# EAGLE design garage_door_remote (EAGLE 6.5.0)
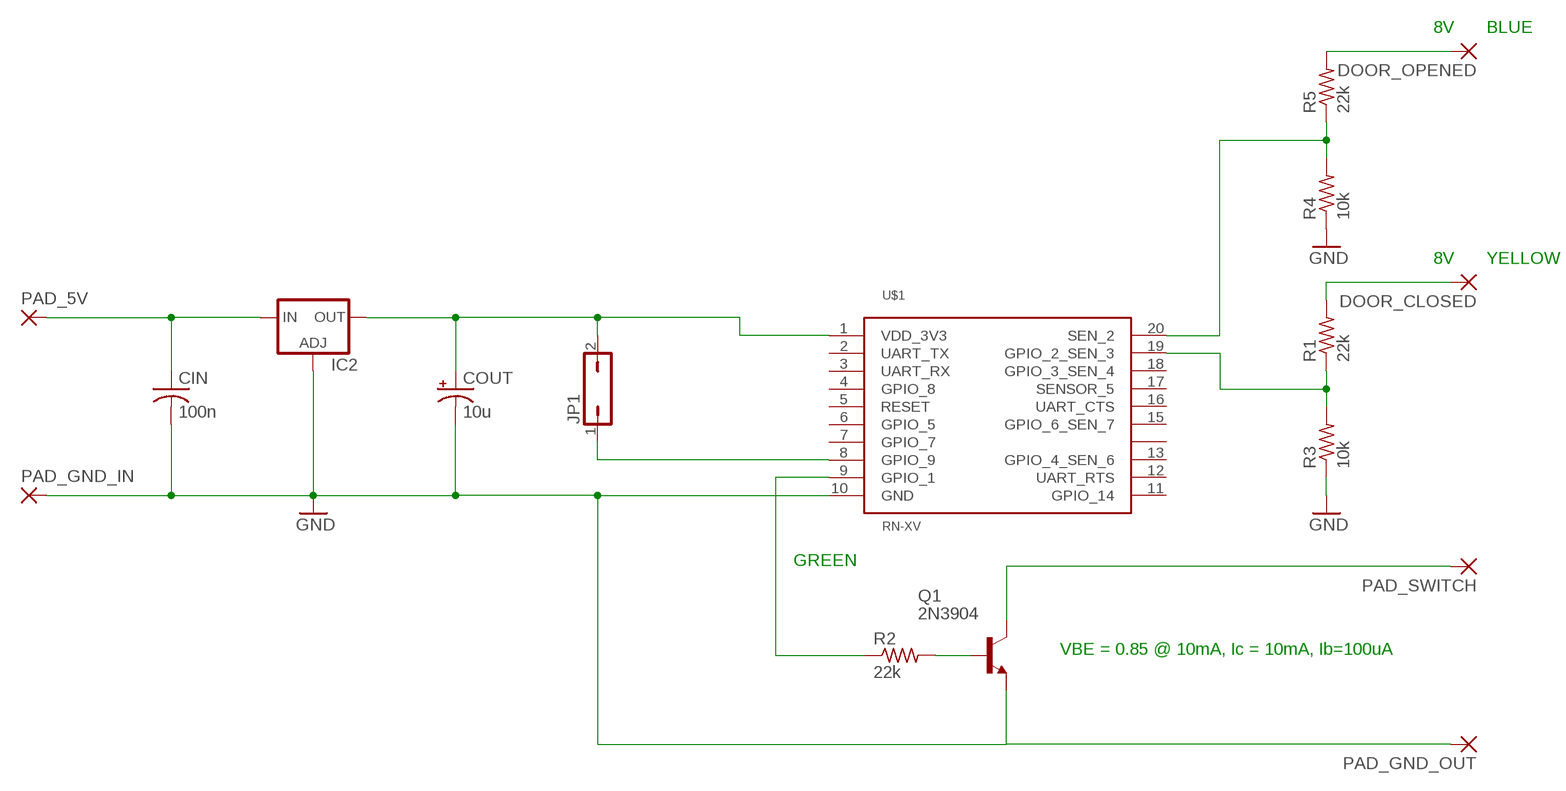
[diagram p0: schematic, sheet 1]

## Parts
CIN  100n  C-US025-024X044  [C025-024X044]
COUT  10u  CPOL-USE2,5-6E  [E2,5-6E]
DOOR_CLOSED  2,54/1,0  [2,54/1,0]
DOOR_OPENED  2,54/1,0  [2,54/1,0]
IC2  LM317TS  [317TS]
JP1  JP1Q  [JP1]
PAD_5V  2,54/1,0  [2,54/1,0]
PAD_GND_IN  2,54/1,0  [2,54/1,0]
PAD_GND_OUT  2,54/1,0  [2,54/1,0]
PAD_SWITCH  2,54/1,0  [2,54/1,0]
Q1  2N3904  [TO92]
R1  22k  R-US_0207/12  [0207/12]
R2  22k  R-US_0207/12  [0207/12]
R3  10k  R-US_0207/12  [0207/12]
R4  10k  R-US_0204/2V  [0204V]
R5  22k  R-US_0204/2V  [0204V]
U$1  RN-XV  [RN-XV]

## Nets
GND: CIN.2 COUT.- IC2.1(ADJ) PAD_GND_IN.1(P) PAD_GND_OUT.1(P) Q1.3(E) R3.1 R4.1 U$1.10(GND)
N$1: JP1.1 U$1.8(GPIO_9)
N$2: COUT.+ IC2.2(OUT) JP1.2 U$1.1(VDD_3V3)
N$3: Q1.2(B) R2.2
N$4: R1.1 R3.2 U$1.19(GPIO_2_SEN_3)
N$5: R4.2 R5.1 U$1.20(SEN_2)
N$6: R2.1 U$1.9(GPIO_1)
N$7: PAD_SWITCH.1(P) Q1.1(C)
N$8: CIN.1 IC2.3(IN) PAD_5V.1(P)
N$9: DOOR_OPENED.1(P) R5.2
N$10: DOOR_CLOSED.1(P) R1.2
Unconnected: U$1.2(UART_TX) U$1.3(UART_RX) U$1.4(GPIO_8) U$1.5(RESET) U$1.6(GPIO_5) U$1.7(GPIO_7) U$1.11(GPIO_14) U$1.12(UART_RTS) U$1.13(GPIO_4_SEN_6) U$1.14(NOT_USED) U$1.15(GPIO_6_SEN_7) U$1.16(UART_CTS) U$1.17(SENSOR_5) U$1.18(GPIO_3_SEN_4)

## Notes on the sheet
- 8V | BLUE
- 8V | YELLOW
- GREEN
- VBE = 0.85 @ 10mA, Ic = 10mA, Ib=100uA

## Library data of the parts
CIN = resistor:C-US: CAPACITOR, American symbol
COUT = resistor:CPOL-US: POLARIZED CAPACITOR, American symbol
DOOR_CLOSED DOOR_OPENED PAD_5V PAD_GND_IN PAD_GND_OUT PAD_SWITCH = wirepad:2,54/1,0: THROUGH-HOLE PAD
IC2 = v-reg:LM317TS: VOLTAGE REGULATOR
JP1 = jumper:JP1Q: JUMPER
Q1 = transistor-npn:2N3904: NPN Transistor
R1-R5 = resistor:R-US_: RESISTOR, American symbol
U$1 = roving-networks:RN-XV: 802.11 b/g module

## Board
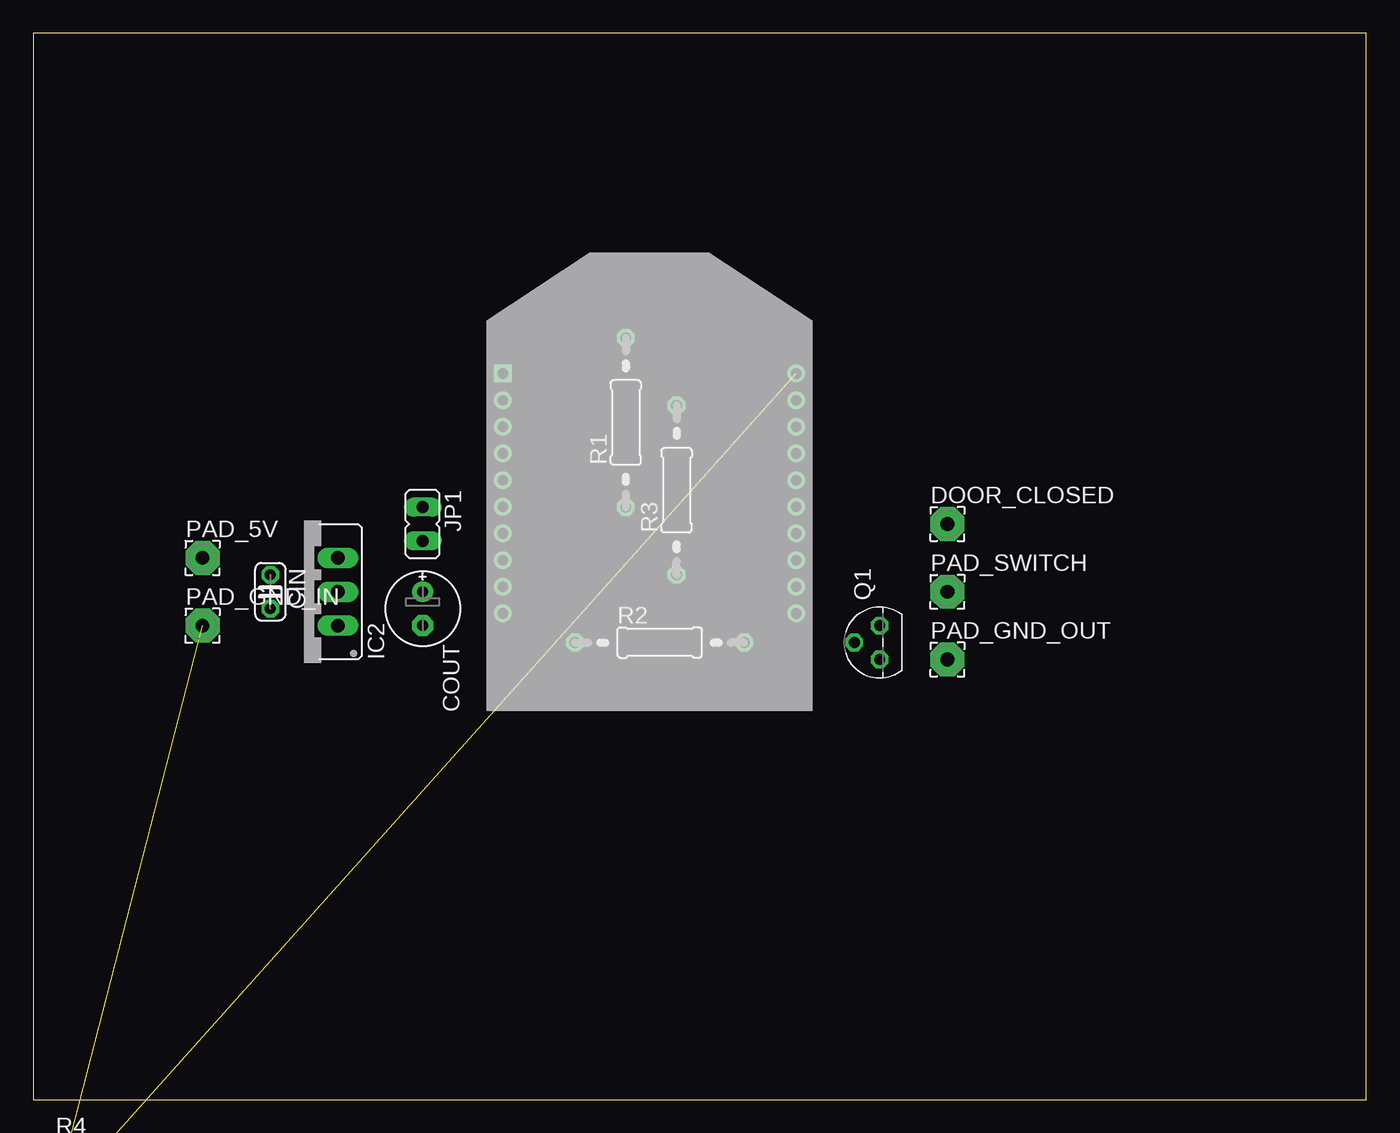
[diagram p1: board, top side]
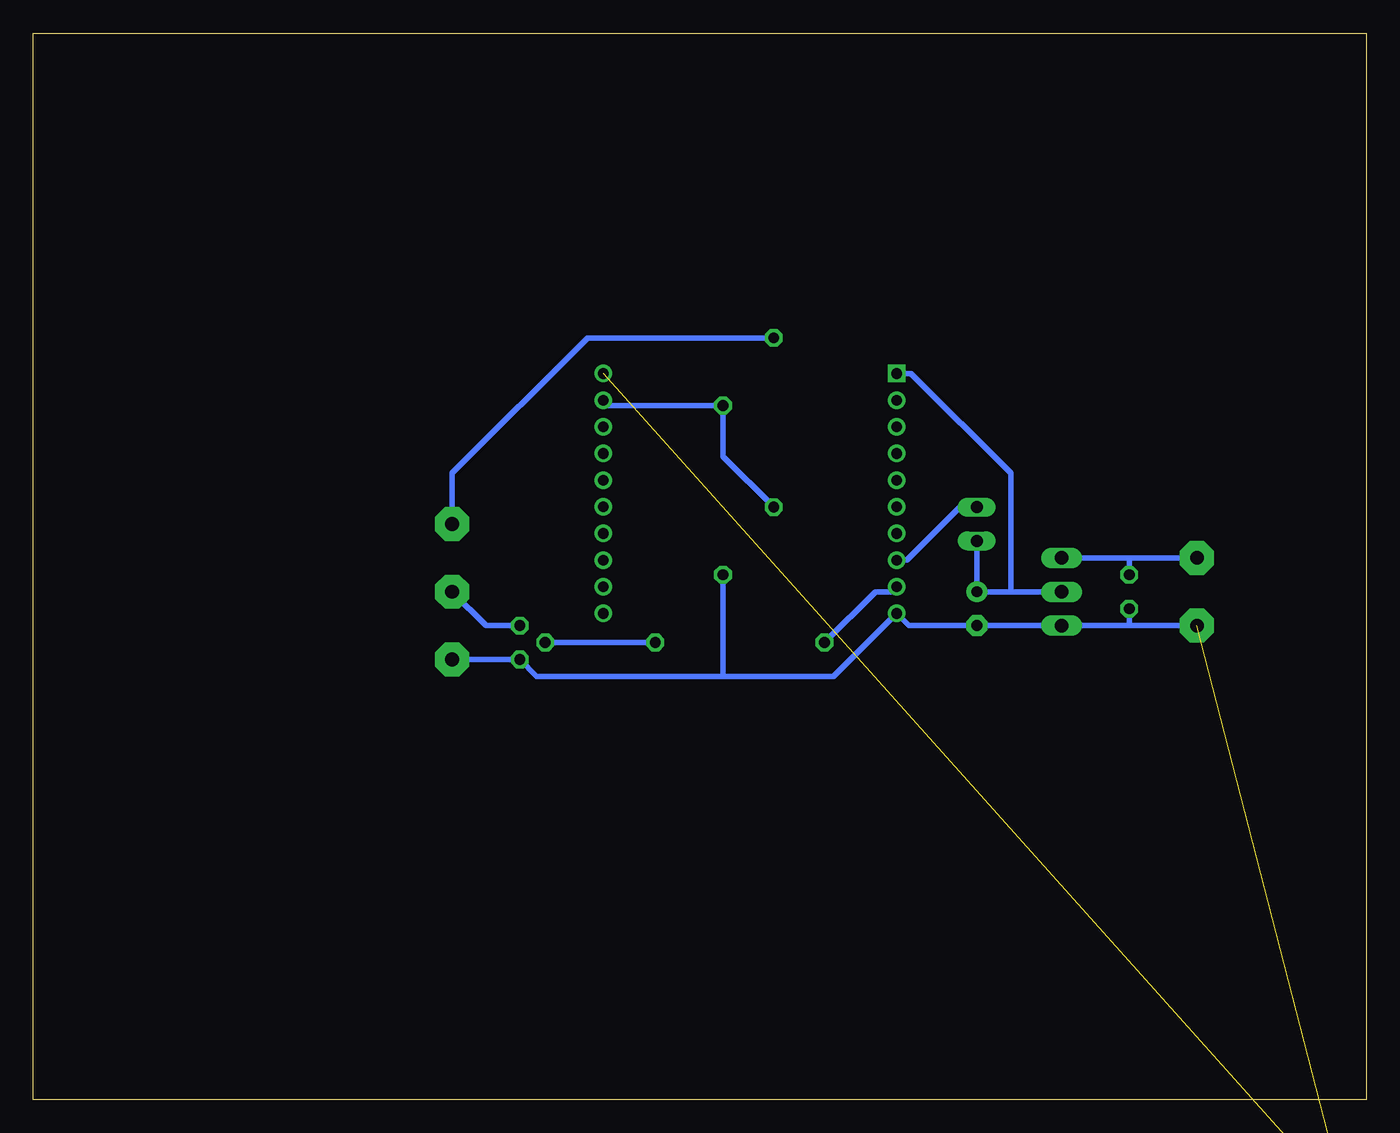
[diagram p2: board, bottom side, seen from below]

Size 100 x 80 mm. Coordinates in mm from the lower left corner, seen from the top.
Outline: 0,0 100,0 100,80 0,80 0,0
Copper layers (1*16): Top 0.035mm / dielectric 1.5mm / Bottom 0.035mm
Design rules "default": minimum track width 10mil, minimum drill 24mil, track to track 8mil, track to pad 8mil, pad to pad 8mil, via to via 8mil, smd to smd 8mil, copper to edge 40mil, drill to drill 8mil, minimum pad ring 10mil, minimum via ring 8mil, stop-mask expansion 4mil, vias tented up to drill 0mil, thermal gap 10mil

### Footprints (pad centres in the part's own frame; a part is rotated, then mirrored left to right if it is on the bottom)
C025-024X044 = drill 0.813 octagon: 1 -1.27,0; 2 1.27,0
E2,5-6E = drill 0.813 pad 1.575: + -1.27,0 | drill 0.813 pad 1.575 octagon: - 1.27,0
2,54/1,0 = drill 1.016 pad 2.54 octagon: 1 0,0
317TS = drill 1.016 long: 1 -2.54,-2.54; 2 0,-2.54; 3 2.54,-2.54
JP1 = drill 0.914 long: 1 0,-1.27; 2 0,1.27
TO92 = drill 0.813 octagon: 1 1.27,0; 2 0,1.905; 3 -1.27,0
0207/12 = drill 0.813 octagon: 1 -6.35,0; 2 6.35,0
0204V = drill 0.813 octagon: 1 -1.27,0; 2 1.27,0
RN-XV = drill 0.8 square: 1 25.264,23.193 | drill 0.8: 2 23.264,23.193; 3 21.264,23.193; 4 19.264,23.193; 5 17.264,23.193; 6 15.264,23.193; 7 13.264,23.193; 8 11.264,23.193; 9 9.264,23.193; 10 7.264,23.193; 11 7.264,1.194; 12 9.264,1.194; 13 11.264,1.194; 14 13.264,1.194; 15 15.264,1.194; 16 17.264,1.194; 17 19.264,1.194; 18 21.264,1.194; 19 23.264,1.194; 20 25.264,1.194

### Placement (x,y rotation side)
CIN  17.78,38.1 270 top
COUT  29.21,36.83 270 top
DOOR_CLOSED  68.58,43.18 0 top
DOOR_OPENED  2.54,-13.97 0 top  (outside the outline)
IC2  20.32,38.1 90 top
JP1  29.21,43.18 180 top
PAD_5V  12.7,40.64 0 top
PAD_GND_IN  12.7,35.56 0 top
PAD_GND_OUT  68.58,33.02 0 top
PAD_SWITCH  68.58,38.1 0 top
Q1  63.5,34.29 90 top
R1  44.45,50.8 90 top
R2  46.99,34.29 0 top
R3  48.26,45.72 90 top
R4  3.81,-3.81 0 top  (outside the outline)
R5  3.81,-8.89 0 top  (outside the outline)
U$1  58.42,29.21 90 top

### Tracks (layer width: path | path; a pad name or v marks a point on that pad's centre or on a via)
GND  (1 unrouted)
  Bottom 0.406: 48.26,31.75 39.95,31.75 U$1.10 34.31,35.56 COUT.- IC2.1 17.78,35.56 | 48.26,31.75 R3.1 | PAD_GND_OUT.1 Q1.3 62.23,31.75 48.26,31.75 | PAD_GND_IN.1 17.78,35.56 | 17.78,35.56 CIN.2
N$1
  Bottom 0.406: U$1.8 34.46,40.47 30.48,44.45 JP1.1
N$2
  Bottom 0.406: IC2.2 26.67,38.1 | 26.67,38.1 COUT.+ JP1.2 | 35.09,54.61 U$1.1 34.15,54.47 26.67,46.99 26.67,38.1
N$3
  Bottom 0.406: R2.2 Q1.2
N$4
  Bottom 0.406: R1.1 48.26,48.26 R3.2 56.82,52.07 U$1.19
N$5  (2 unrouted)
N$6
  Bottom 0.406: U$1.9 35.6,38.1 36.83,38.1 R2.1
N$7
  Bottom 0.406: Q1.1 66.04,35.56 PAD_SWITCH.1
N$8
  Bottom 0.406: PAD_5V.1 17.78,40.64 | 17.78,40.64 IC2.3 | 17.78,40.64 CIN.1
N$9  (1 unrouted)
N$10
  Bottom 0.406: R1.2 58.42,57.15 68.58,46.99 DOOR_CLOSED.1